# EAGLE schematic Hive 1.3 (EAGLE 9.6.2)
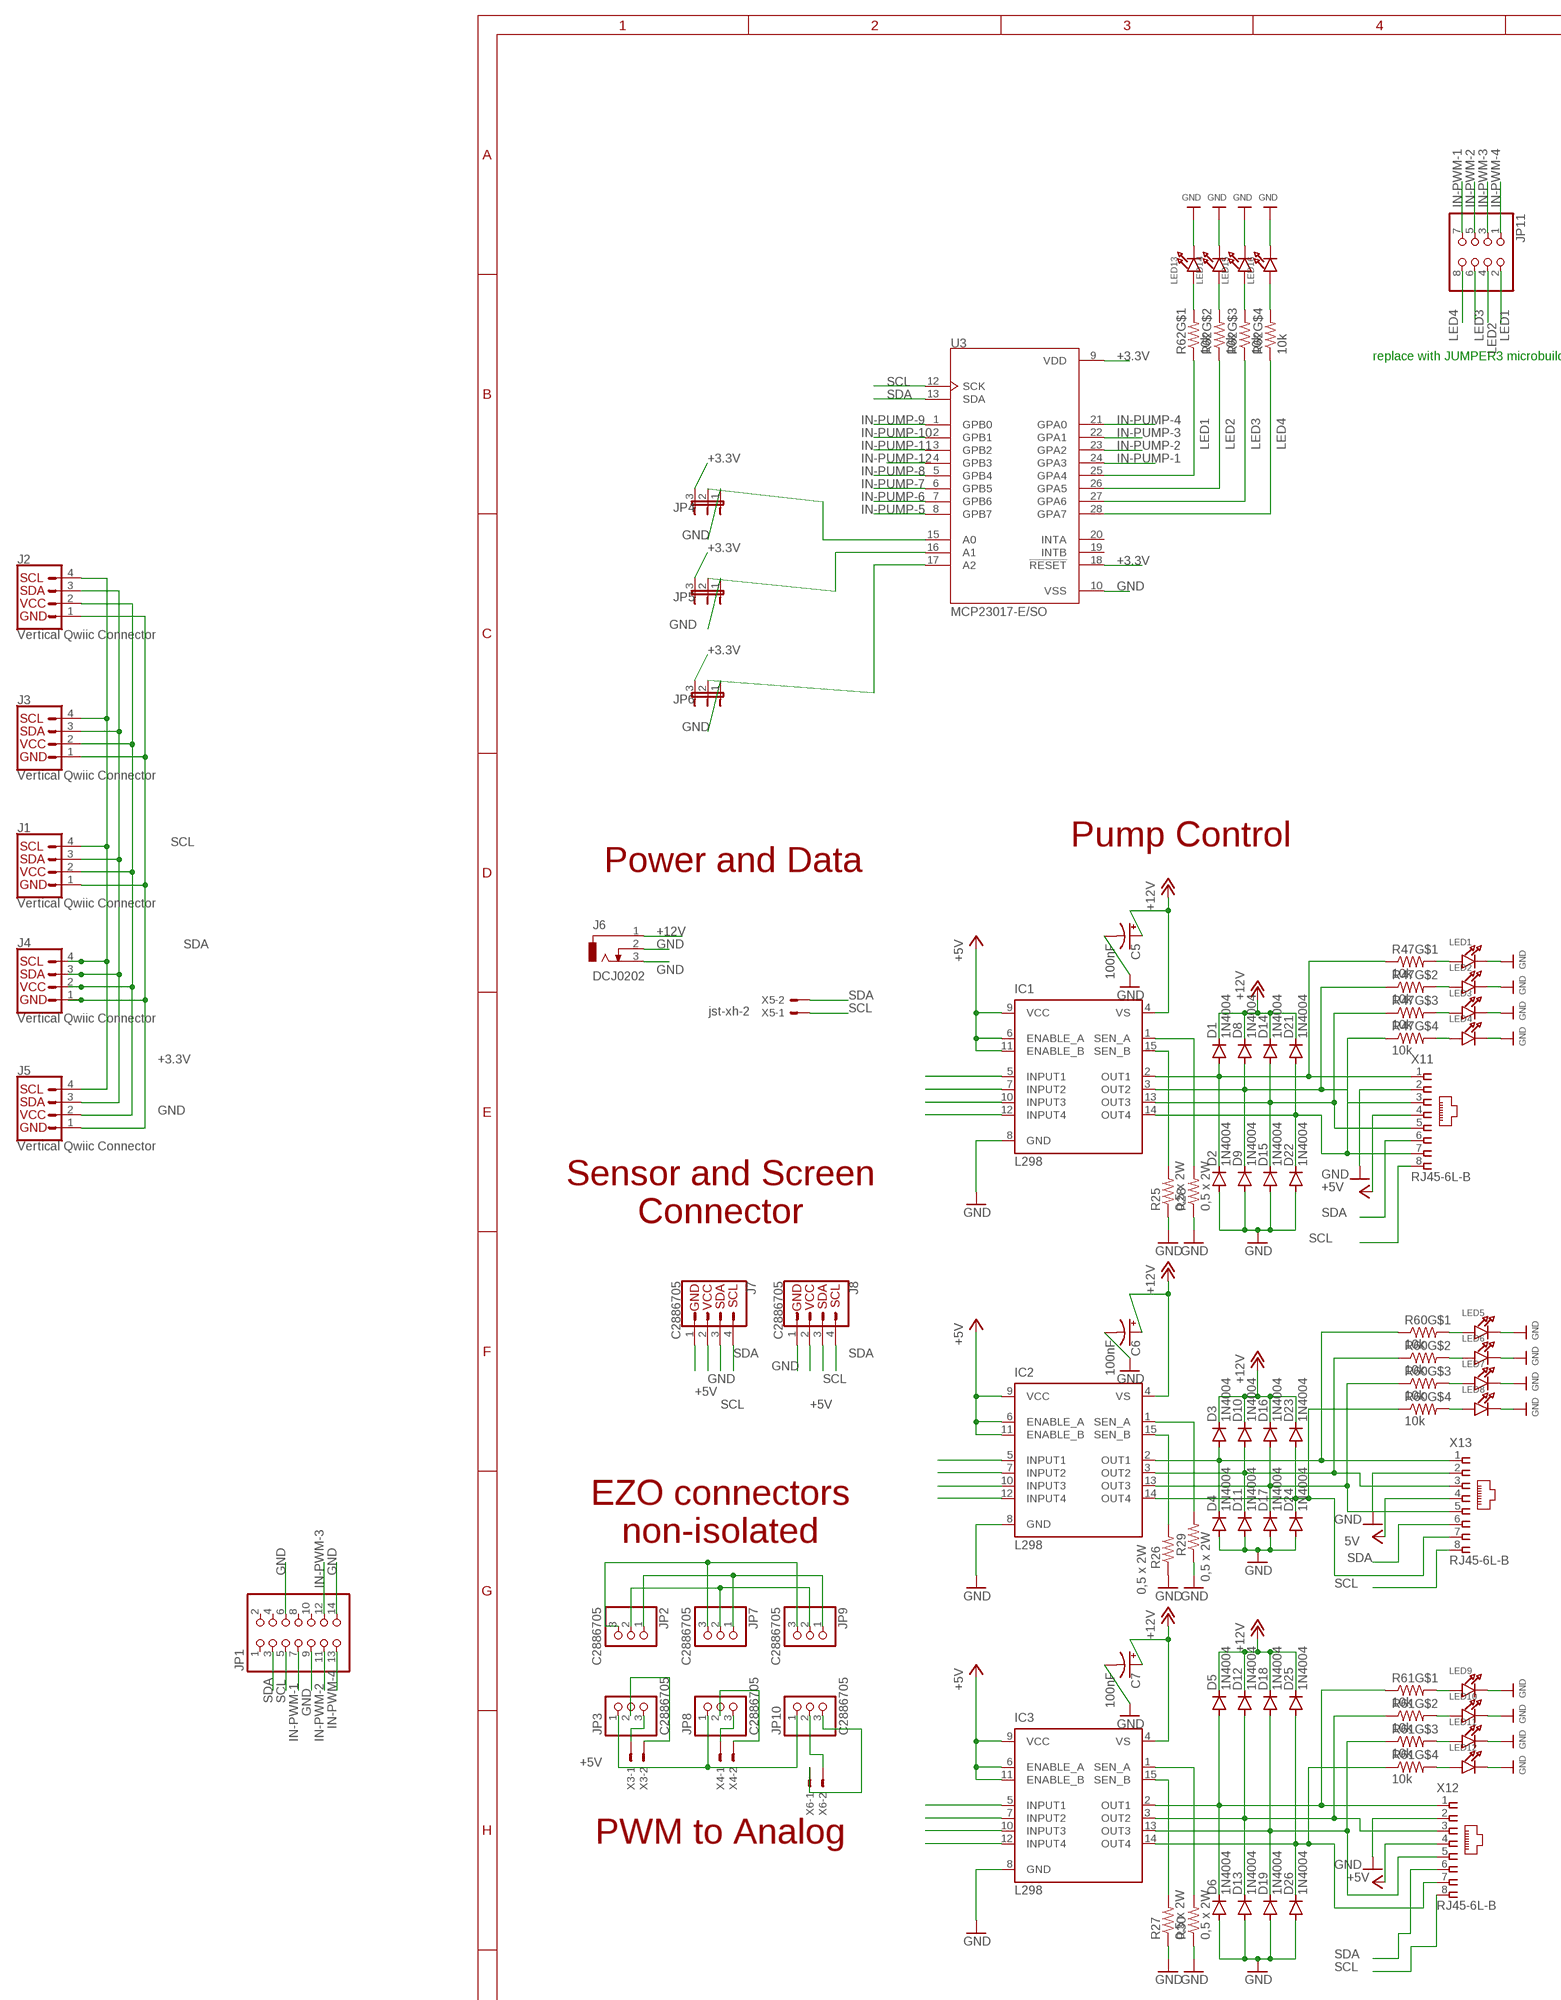
[diagram p0: schematic, sheet 1, part 1 of 3]
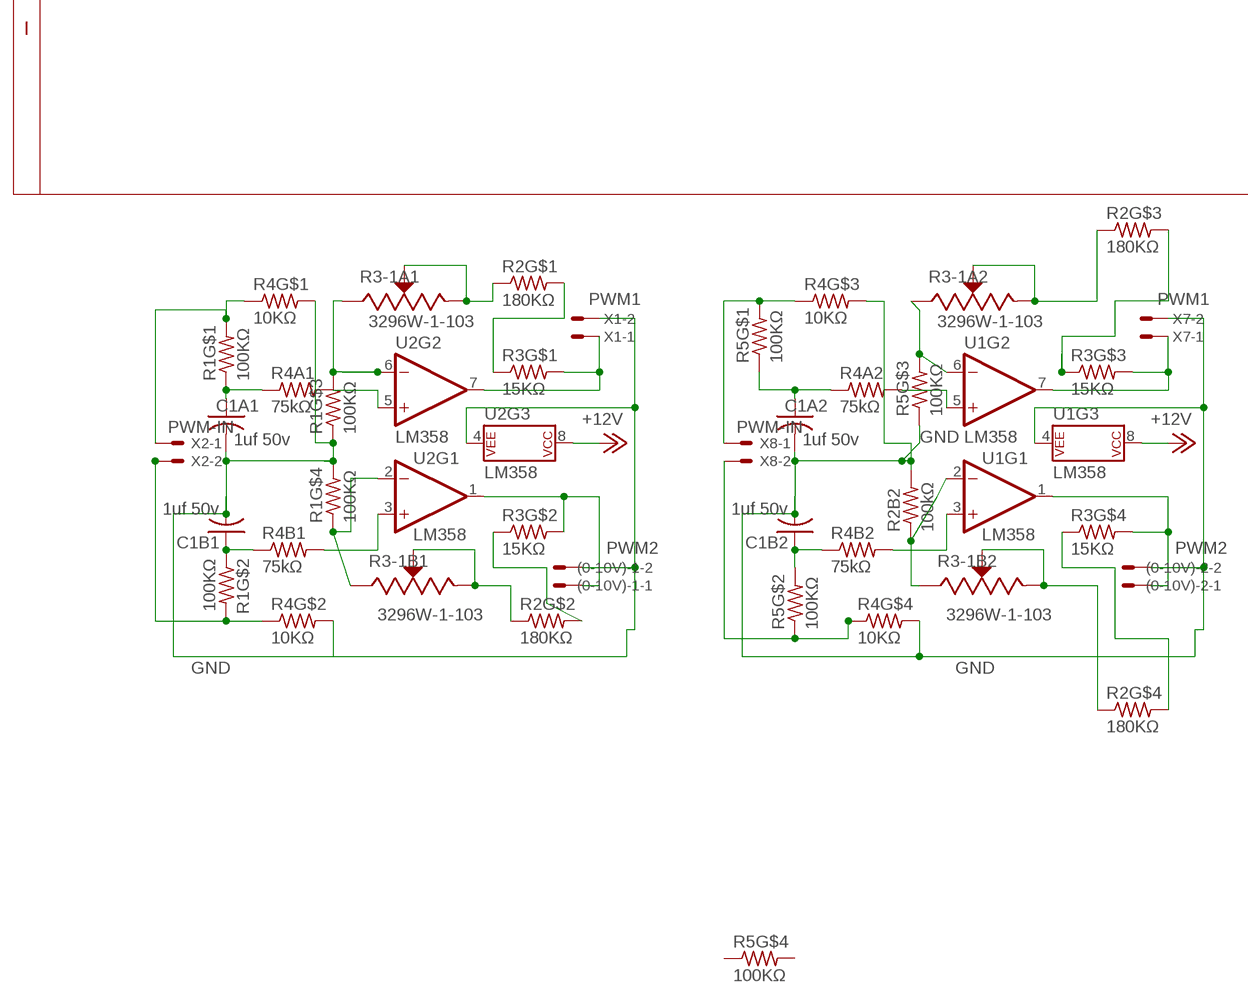
[diagram p1: schematic, sheet 1, part 2 of 3]
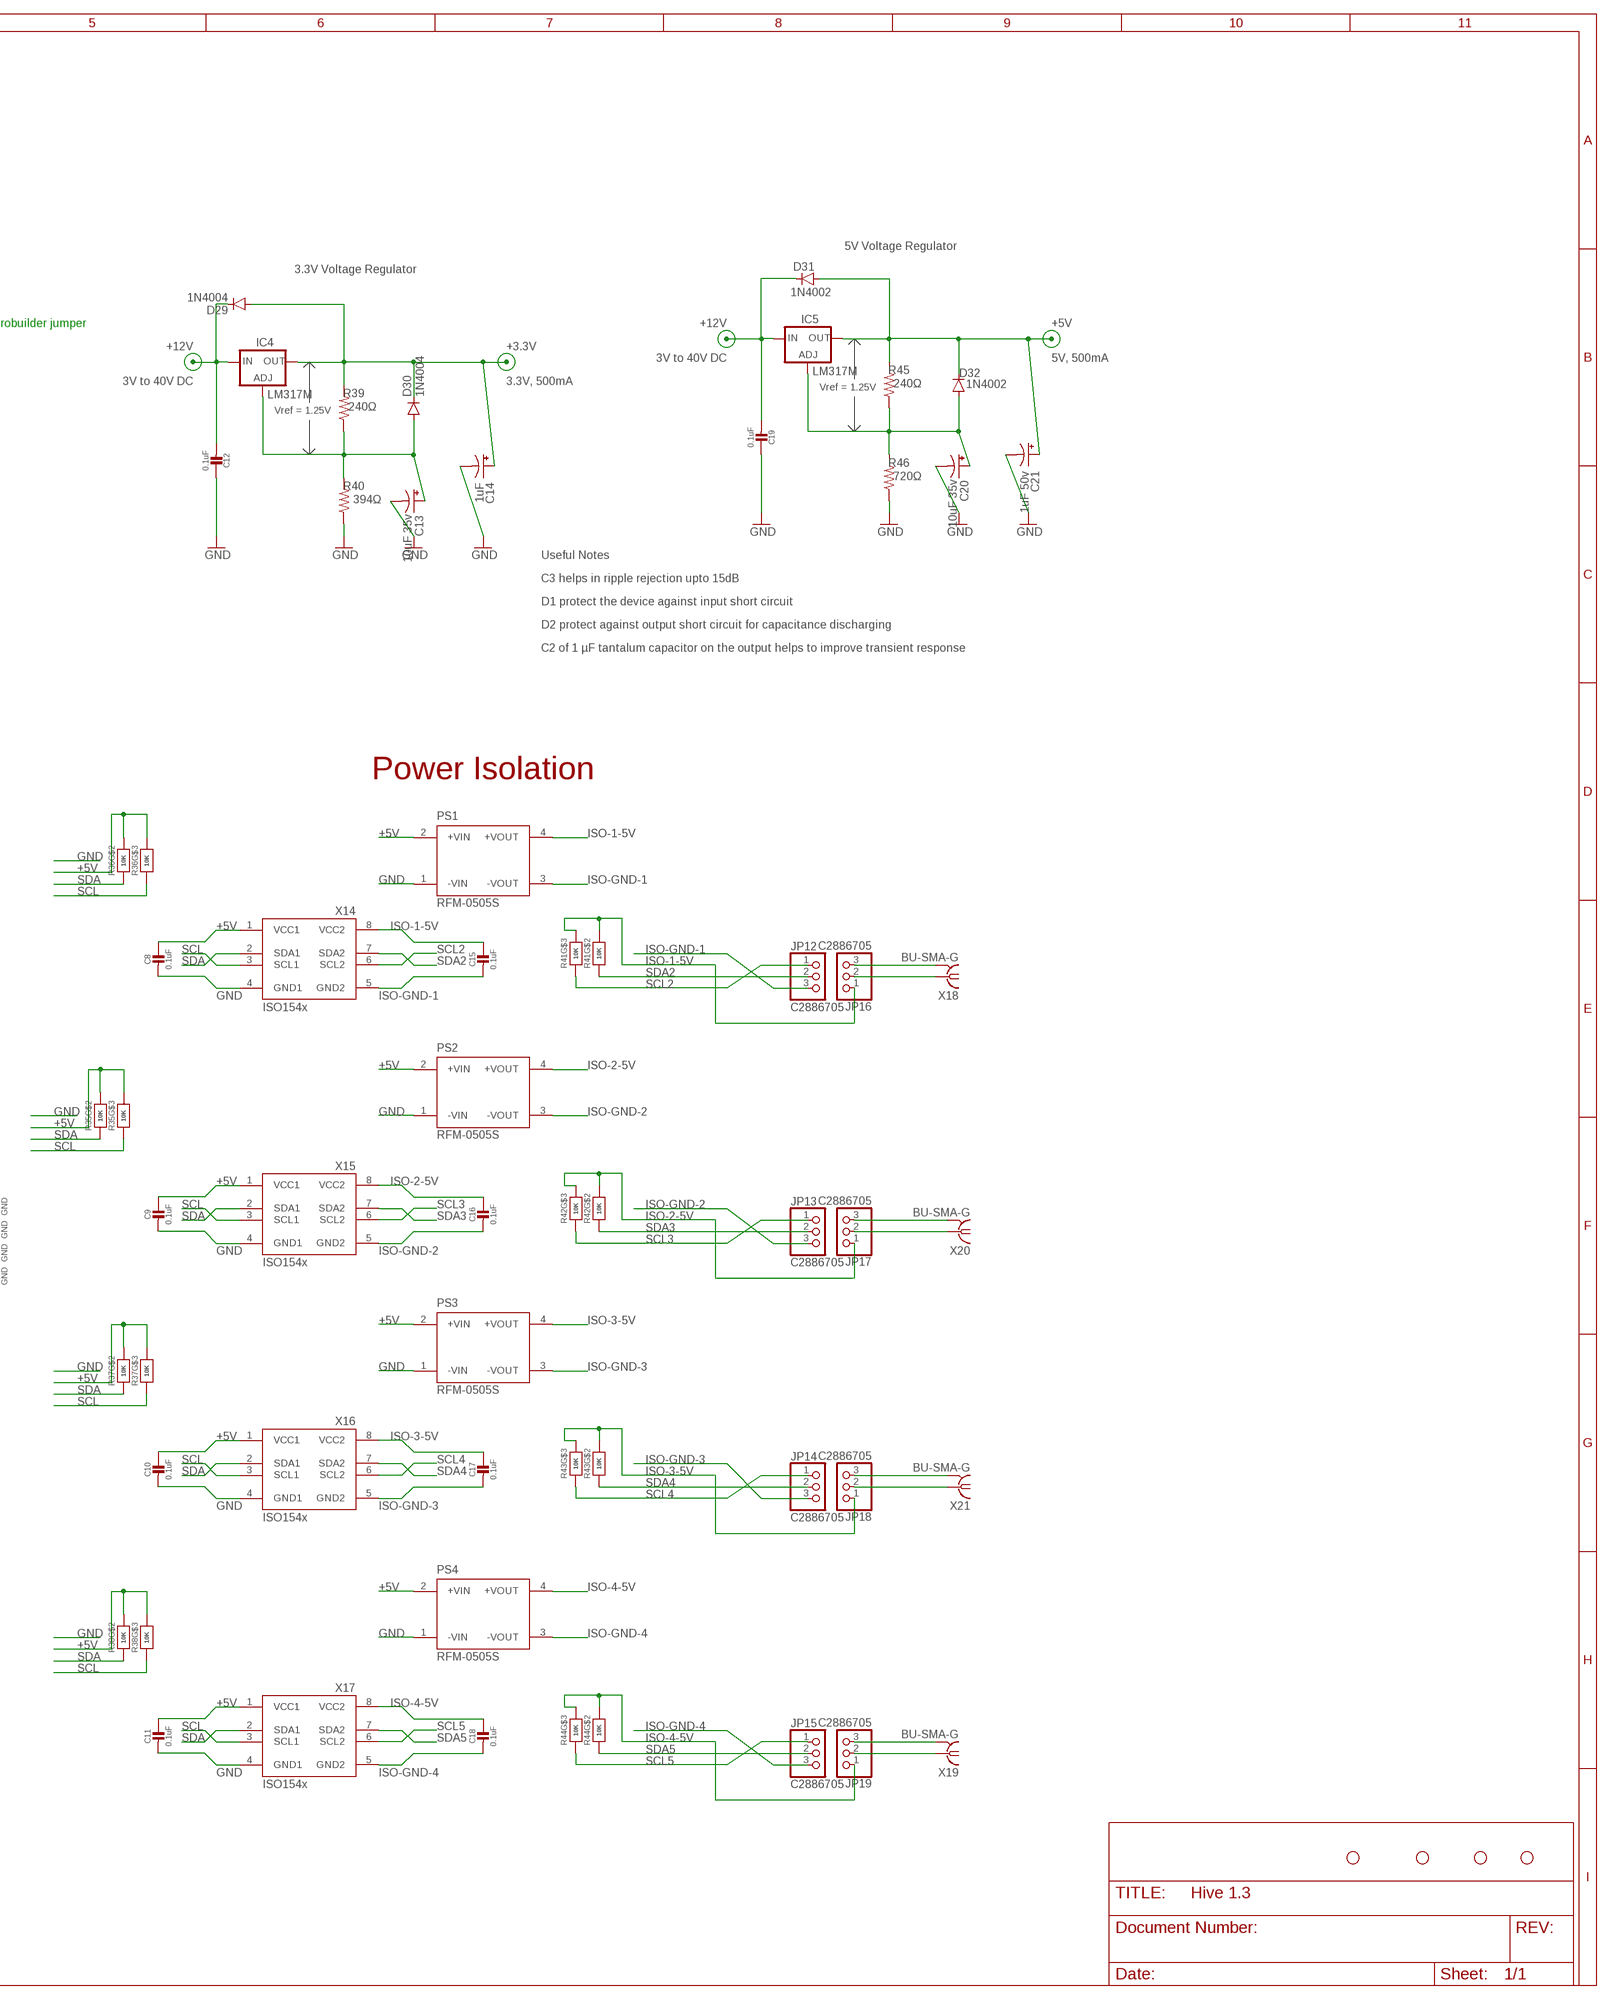
[diagram p2: schematic, sheet 1, part 3 of 3]

## Parts
(0-10V)-1  PWM2  JST-XH-02-PIN-LONG-PAD  [JST-XH-02-PACKAGE-LONG-PAD]
(0-10V)-2  PWM2  JST-XH-02-PIN-LONG-PAD  [JST-XH-02-PACKAGE-LONG-PAD]
C1A1  1uf 50v  C-USC1206  [C1206]
C1A2  1uf 50v  C-USC1206  [C1206]
C1B1  1uf 50v  C-USC1206  [C1206]
C1B2  1uf 50v  C-USC1206  [C1206]
C5  100nF  CPOL-USUD-4X5,8  [UD-4X5,8_NICHICON]
C6  100nF  CPOL-USUD-4X5,8  [UD-4X5,8_NICHICON]
C7  100nF  CPOL-USUD-4X5,8  [UD-4X5,8_NICHICON]
C8  0.1uF  CAP_CERAMIC0603_NO  [0603-NO]
C9  0.1uF  CAP_CERAMIC0603_NO  [0603-NO]
C10  0.1uF  CAP_CERAMIC0603_NO  [0603-NO]
C11  0.1uF  CAP_CERAMIC0603_NO  [0603-NO]
C12  0.1uF  CAP_CERAMIC0603_NO  [0603-NO]
C13  10uF 35v  CPOL-USUD-4X5,8  [UD-4X5,8_NICHICON]
C14  1uF  CPOL-USUD-4X5,8  [UD-4X5,8_NICHICON]
C15  0.1uF  CAP_CERAMIC0603_NO  [0603-NO]
C16  0.1uF  CAP_CERAMIC0603_NO  [0603-NO]
C17  0.1uF  CAP_CERAMIC0603_NO  [0603-NO]
C18  0.1uF  CAP_CERAMIC0603_NO  [0603-NO]
C19  0.1uF  CAP_CERAMIC0603_NO  [0603-NO]
C20  10uF 35v  CPOL-USUD-4X5,8  [UD-4X5,8_NICHICON]
C21  1uF 50v  CPOL-USUD-4X5,8  [UD-4X5,8_NICHICON]
D1  1N4004  DIODE-DO214BA  [DO214BA]
D2  1N4004  DIODE-DO214BA  [DO214BA]
D3  1N4004  DIODE-DO214BA  [DO214BA]
D4  1N4004  DIODE-DO214BA  [DO214BA]
D5  1N4004  DIODE-DO214BA  [DO214BA]
D6  1N4004  DIODE-DO214BA  [DO214BA]
D8  1N4004  DIODE-DO214BA  [DO214BA]
D9  1N4004  DIODE-DO214BA  [DO214BA]
D10  1N4004  DIODE-DO214BA  [DO214BA]
D11  1N4004  DIODE-DO214BA  [DO214BA]
D12  1N4004  DIODE-DO214BA  [DO214BA]
D13  1N4004  DIODE-DO214BA  [DO214BA]
D14  1N4004  DIODE-DO214BA  [DO214BA]
D15  1N4004  DIODE-DO214BA  [DO214BA]
D16  1N4004  DIODE-DO214BA  [DO214BA]
D17  1N4004  DIODE-DO214BA  [DO214BA]
D18  1N4004  DIODE-DO214BA  [DO214BA]
D19  1N4004  DIODE-DO214BA  [DO214BA]
D21  1N4004  DIODE-DO214BA  [DO214BA]
D22  1N4004  DIODE-DO214BA  [DO214BA]
D23  1N4004  DIODE-DO214BA  [DO214BA]
D24  1N4004  DIODE-DO214BA  [DO214BA]
D25  1N4004  DIODE-DO214BA  [DO214BA]
D26  1N4004  DIODE-DO214BA  [DO214BA]
D29  1N4004  DIODE-DO214BA  [DO214BA]
D30  1N4004  DIODE-DO214BA  [DO214BA]
D31  1N4002  DIODE-DO214BA  [DO214BA]
D32  1N4002  DIODE-DO214BA  [DO214BA]
H1  STAND-OFF  [STAND-OFF]
H2  STAND-OFF  [STAND-OFF]
H3  STAND-OFF  [STAND-OFF]
H4  STAND-OFF  [STAND-OFF]
IC1  L298  [MULTIWATT-15]
IC2  L298  [MULTIWATT-15]
IC3  L298  [MULTIWATT-15]
IC4  LM317MBSTT3  [SOT223]
IC5  LM317MBSTT3  [SOT223]
J1  Vertical Qwiic Connector  QWIIC_CONNECTOR  [JST04_1MM_VERT]
J2  Vertical Qwiic Connector  QWIIC_CONNECTOR  [JST04_1MM_VERT]
J3  Vertical Qwiic Connector  QWIIC_CONNECTOR  [JST04_1MM_VERT]
J4  Vertical Qwiic Connector  QWIIC_CONNECTOR  [JST04_1MM_VERT]
J5  Vertical Qwiic Connector  QWIIC_CONNECTOR  [JST04_1MM_VERT]
J6  DCJ0202  [DCJ0202]
J7  C2886705  I2C_STANDARD  [1X04]
J8  C2886705  I2C_STANDARD  [1X04]
JP1  PINHD-2X7  [2X07]
JP2  C2886705  PINHD-1X3CB  [1X03-CLEANBIG]
JP3  C2886705  PINHD-1X3CB  [1X03-CLEANBIG]
JP4  JUMPER3  [JUMPER3]
JP5  JUMPER3  [JUMPER3]
JP6  JUMPER3  [JUMPER3]
JP7  C2886705  PINHD-1X3CB  [1X03-CLEANBIG]
JP8  C2886705  PINHD-1X3CB  [1X03-CLEANBIG]
JP9  C2886705  PINHD-1X3CB  [1X03-CLEANBIG]
JP10  C2886705  PINHD-1X3CB  [1X03-CLEANBIG]
JP11  PINHD-2X4  [2X04]
JP12  C2886705  PINHD-1X3CB  [1X03-CLEANBIG]
JP13  C2886705  PINHD-1X3CB  [1X03-CLEANBIG]
JP14  C2886705  PINHD-1X3CB  [1X03-CLEANBIG]
JP15  C2886705  PINHD-1X3CB  [1X03-CLEANBIG]
JP16  C2886705  PINHD-1X3CB  [1X03-CLEANBIG]
JP17  C2886705  PINHD-1X3CB  [1X03-CLEANBIG]
JP18  C2886705  PINHD-1X3CB  [1X03-CLEANBIG]
JP19  C2886705  PINHD-1X3CB  [1X03-CLEANBIG]
LED1  LED0603  [CHIPLED_0603]
LED2  LED0603  [CHIPLED_0603]
LED3  LED0603  [CHIPLED_0603]
LED4  LED0603  [CHIPLED_0603]
LED5  LED0603  [CHIPLED_0603]
LED6  LED0603  [CHIPLED_0603]
LED7  LED0603  [CHIPLED_0603]
LED8  LED0603  [CHIPLED_0603]
LED9  LED0603  [CHIPLED_0603]
LED10  LED0603  [CHIPLED_0603]
LED11  LED0603  [CHIPLED_0603]
LED12  LED0603  [CHIPLED_0603]
LED13  LED0603  [CHIPLED_0603]
LED14  LED0603  [CHIPLED_0603]
LED15  LED0603  [CHIPLED_0603]
LED16  LED0603  [CHIPLED_0603]
PS1  RFM-0505S  [CONV_RFM-0505S]
PS2  RFM-0505S  [CONV_RFM-0505S]
PS3  RFM-0505S  [CONV_RFM-0505S]
PS4  RFM-0505S  [CONV_RFM-0505S]
R1  100KΩ  RESISTOR_4PACK_US  [RESPACK_4X0603]
R2  180KΩ  RESISTOR_4PACK_US  [RESPACK_4X0603]
R2B2  100kΩ  R-US_M1206  [M1206]
R3  15KΩ  RESISTOR_4PACK_US  [RESPACK_4X0603]
R3-1A1  3296W-1-103  [TRIM_3296W-1-103]
R3-1A2  3296W-1-103  [TRIM_3296W-1-103]
R3-1B1  3296W-1-103  [TRIM_3296W-1-103]
R3-1B2  3296W-1-103  [TRIM_3296W-1-103]
R4  10KΩ  RESISTOR_4PACK_US  [RESPACK_4X0603]
R4A1  75kΩ  R-US_M1206  [M1206]
R4A2  75kΩ  R-US_M1206  [M1206]
R4B1  75kΩ  R-US_M1206  [M1206]
R4B2  75kΩ  R-US_M1206  [M1206]
R5  100KΩ  RESISTOR_4PACK_US  [RESPACK_4X0603]
R25  0,5 x 2W  R-US_R2512  [R2512]
R26  0,5 x 2W  R-US_R2512  [R2512]
R27  0,5 x 2W  R-US_R2512  [R2512]
R28  0,5 x 2W  R-US_R2512  [R2512]
R29  0,5 x 2W  R-US_R2512  [R2512]
R30  0,5 x 2W  R-US_R2512  [R2512]
R35  10K  RESISTOR_4PACK  [RESPACK_4X0603]
R36  10K  RESISTOR_4PACK  [RESPACK_4X0603]
R37  10K  RESISTOR_4PACK  [RESPACK_4X0603]
R38  10K  RESISTOR_4PACK  [RESPACK_4X0603]
R39  240Ω  R-US_M0805  [M0805]
R40  394Ω  R-US_M0805  [M0805]
R41  10K  RESISTOR_4PACK  [RESPACK_4X0603]
R42  10K  RESISTOR_4PACK  [RESPACK_4X0603]
R43  10K  RESISTOR_4PACK  [RESPACK_4X0603]
R44  10K  RESISTOR_4PACK  [RESPACK_4X0603]
R45  240Ω  R-US_M0805  [M0805]
R46  720Ω  R-US_M0805  [M0805]
R47  10k  RESISTOR_4PACK_US  [RESPACK_4X0603]
R60  10k  RESISTOR_4PACK_US  [RESPACK_4X0603]
R61  10k  RESISTOR_4PACK_US  [RESPACK_4X0603]
R62  10k  RESISTOR_4PACK_US  [RESPACK_4X0603]
U1  LM358  [DIP08]
U2  LM358  [DIP08]
U3  MCP23017-E/SO  [SOIC127P1030X265-28N]
X1  PWM1  JST-XH-02-PIN-LONG-PAD  [JST-XH-02-PACKAGE-LONG-PAD]
X2  PWM-IN  JST-XH-02-PIN-LONG-PAD  [JST-XH-02-PACKAGE-LONG-PAD]
X3  jst-xh-2  JST-XH-02-PIN-LONG-PAD  [JST-XH-02-PACKAGE-LONG-PAD]
X4  jst-xh-2  JST-XH-02-PIN-LONG-PAD  [JST-XH-02-PACKAGE-LONG-PAD]
X5  jst-xh-2  JST-XH-02-PIN-LONG-PAD  [JST-XH-02-PACKAGE-LONG-PAD]
X6  jst-xh-2  JST-XH-02-PIN-LONG-PAD  [JST-XH-02-PACKAGE-LONG-PAD]
X7  PWM1  JST-XH-02-PIN-LONG-PAD  [JST-XH-02-PACKAGE-LONG-PAD]
X8  PWM-IN  JST-XH-02-PIN-LONG-PAD  [JST-XH-02-PACKAGE-LONG-PAD]
X11  RJ45-6L-B  [RJ45-NO-SHIELD]
X12  RJ45-6L-B  [RJ45-NO-SHIELD]
X13  RJ45-6L-B  [RJ45-NO-SHIELD]
X14  ISO154X  [SOIC8_150MIL]
X15  ISO154X  [SOIC8_150MIL]
X16  ISO154X  [SOIC8_150MIL]
X17  ISO154X  [SOIC8_150MIL]
X18  BU-SMA-G  [BU-SMA-G]
X19  BU-SMA-G  [BU-SMA-G]
X20  BU-SMA-G  [BU-SMA-G]
X21  BU-SMA-G  [BU-SMA-G]

## Nets
+3.3V [3.3v]: C14.+ D29.A D30.C IC4.4(OUT) J1.2 J2.2 J3.2 J4.2 J5.2 JP4.3 JP5.3 JP6.3 R39.2 U3.9(VDD) U3.18(!RESET)
+5V [5v]: C8.1 C9.1 C10.1 C11.1 C21.+ D31.A D32.C IC1.6(ENABLE_A) IC1.9(VCC) IC1.11(ENABLE_B) IC2.6(ENABLE_A) IC2.9(VCC) IC2.11(ENABLE_B) IC3.6(ENABLE_A) IC3.9(VCC) IC3.11(ENABLE_B) IC5.4(OUT) J7.1 J8.2 JP3.1 JP8.1 JP10.1 PS1.2(+VIN) PS2.2(+VIN) PS3.2(+VIN) PS4.2(+VIN) R35.6 R35.7 R36.6 R36.7 R37.6 R37.7 R38.6 R38.7 R45.2 X11.4 X12.4 X13.4 X14.1(VCC1) X15.1(VCC1) X16.1(VCC1) X17.1(VCC1) ; supply symbol labelled +3V3
+12V [12v]: C5.+ C6.+ C7.+ C12.2 C19.2 D1.C D3.C D5.C D8.C D10.C D12.C D14.C D16.C D18.C D21.C D23.C D25.C D29.C D31.C IC1.4(VS) IC2.4(VS) IC3.4(VS) IC4.3(IN) IC5.3(IN) J6.1 U1.8(P$V+) U2.8(P$V+)
GND: (0-10V)-1.2 (0-10V)-2.2 C1A1.2 C1A2.2 C1B1.2 C1B2.2 C5.- C6.- C7.- C8.2 C9.2 C10.2 C11.2 C12.1 C13.- C14.- C19.1 C20.- C21.- D2.A D4.A D6.A D9.A D11.A D13.A D15.A D17.A D19.A D22.A D24.A D26.A IC1.8(GND) IC2.8(GND) IC3.8(GND) J1.1 J2.1 J3.1 J4.1 J5.1 J6.2 J6.3 J7.2 J8.1 JP1.6 JP1.9 JP1.14 JP2.3 JP4.1 JP5.1 JP6.1 JP7.3 JP9.3 LED1.C LED2.C LED3.C LED4.C LED5.C LED6.C LED7.C LED8.C LED9.C LED10.C LED11.C LED12.C LED13.C LED14.C LED15.C LED16.C PS1.1(-VIN) PS2.1(-VIN) PS3.1(-VIN) PS4.1(-VIN) R1.3 R1.5 R2B2.2 R4.5 R4.6 R4.7 R4.8 R5.3 R25.1 R26.1 R27.1 R28.1 R29.1 R30.1 R40.1 R46.1 U1.4(P$V-) U2.4(P$V-) U3.10(VSS) X1.2 X7.2 X11.2 X12.2 X13.2 X14.4(GND1) X15.4(GND1) X16.4(GND1) X17.4(GND1)
IN-PUMP-1: IC2.5(INPUT1) U3.24(GPA3)
IN-PUMP-2: IC2.7(INPUT2) U3.23(GPA2)
IN-PUMP-3: IC2.10(INPUT3) U3.22(GPA1)
IN-PUMP-4: IC2.12(INPUT4) U3.21(GPA0)
IN-PUMP-5 [GPIO]: IC1.5(INPUT1) U3.8(GPB7)
IN-PUMP-6 [GPIO]: IC1.7(INPUT2) U3.7(GPB6)
IN-PUMP-7 [GPIO]: IC1.10(INPUT3) U3.6(GPB5)
IN-PUMP-8 [GPIO]: IC1.12(INPUT4) U3.5(GPB4)
IN-PUMP-9 [GPIO]: IC3.5(INPUT1) U3.1(GPB0)
IN-PUMP-10 [GPIO]: IC3.7(INPUT2) U3.2(GPB1)
IN-PUMP-11 [GPIO]: IC3.10(INPUT3) U3.3(GPB2)
IN-PUMP-12 [GPIO]: IC3.12(INPUT4) U3.4(GPB3)
IN-PWM-1: JP1.7 JP11.7
IN-PWM-2: JP1.11 JP11.5
IN-PWM-3: JP1.12 JP11.3
IN-PWM-4: JP1.13 JP11.1
IN-PWM-5: R1.8 R4.1 X2.1
IN-PWM-6: R1.7 R4.2 X2.2
IN-PWM-7: R4.3 R5.8 X8.1
IN-PWM-8: R4.4 R5.2 X8.2
ISO-1-5V: C15.1 JP16.1 PS1.4(+VOUT) R41.6 R41.7 X14.8(VCC2)
ISO-2-5V: C16.1 JP17.1 PS2.4(+VOUT) R42.6 R42.7 X15.8(VCC2)
ISO-3-5V: C17.1 JP18.1 PS3.4(+VOUT) R43.6 R43.7 X16.8(VCC2)
ISO-4-5V: C18.1 JP19.1 PS4.4(+VOUT) R44.6 R44.7 X17.8(VCC2)
ISO-GND-1: C15.2 JP12.3 PS1.3(-VOUT) X14.5(GND2)
ISO-GND-2: C16.2 JP13.3 PS2.3(-VOUT) X15.5(GND2)
ISO-GND-3: C17.2 JP14.3 PS3.3(-VOUT) X16.5(GND2)
ISO-GND-4: C18.2 JP15.3 PS4.3(-VOUT) X17.5(GND2)
LED1: JP11.2 R62.1 U3.25(GPA4)
LED2: JP11.4 R62.2 U3.26(GPA5)
LED3: JP11.6 R62.3 U3.27(GPA6)
LED4: JP11.8 R62.4 U3.28(GPA7)
N$1: IC1.1(SEN_A) R28.2
N$2: IC1.15(SEN_B) R25.2
N$3: IC3.1(SEN_A) R30.2
N$4: IC3.15(SEN_B) R27.2
N$5: C13.+ D30.A IC4.1(ADJ) R39.1 R40.2
N$6: R1.6 R3-1A1.1(CCW) U2.6(-IN)
N$7: LED13.A R62.8
N$8: R1.4 R3-1B1.1(CCW) U2.2(-IN)
N$9: IC2.1(SEN_A) R29.2
N$10: IC2.15(SEN_B) R26.2
N$11: C20.+ D32.A IC5.1(ADJ) R45.1 R46.2
N$12: JP19.3 X19.2 X19.3 X19.4 X19.5
N$13: LED14.A R62.7
N$14: JP17.3 X20.2 X20.3 X20.4 X20.5
N$15: JP18.3 X21.2 X21.3 X21.4 X21.5
N$16: JP16.2 X18.1
N$17: R2.2 R3-1B1.2(WIPER) R3-1B1.3(CW)
N$18: R2.7 R3.2
N$19: R2.1 R3-1A1.2(WIPER) R3-1A1.3(CW)
N$20: R2.8 R3.1
N$21: C1A1.1 R1.1 R4A1.1
N$22: C1B1.1 R1.2 R4B1.1
N$23: LED9.A R61.8
N$24: LED10.A R61.7
N$25: R4A1.2 U2.5(+IN)
N$26: R4B1.2 U2.3(+IN)
N$27: R2.4 R3-1B2.2(WIPER) R3-1B2.3(CW)
N$28: LED11.A R61.6
N$29: LED12.A R61.5
N$30: LED8.A R60.5
N$31: JP10.2 X6.2
N$32: JP17.2 X20.1
N$33: JP10.3 X6.1
N$34: JP8.3 X4.1
N$35: JP8.2 X4.2
N$36: JP18.2 X21.1
N$37: JP3.3 X3.1
N$38: JP3.2 X3.2
N$39: LED7.A R60.6
N$40: JP19.2 X19.1
N$41: LED6.A R60.7
N$42: JP16.3 X18.2 X18.3 X18.4 X18.5
N$43: LED5.A R60.8
N$44: LED1.A R47.8
N$45: LED2.A R47.7
N$46: LED3.A R47.6
N$47: LED4.A R47.5
N$48: LED15.A R62.6
N$49: LED16.A R62.5
N$50: R2.5 R3.4
N$51: R2.3 R3-1A2.2(WIPER) R3-1A2.3(CW)
N$52: R2.6 R3.3
N$53: C1A2.1 R4A2.1 R5.1
N$54: C1B2.1 R4B2.1 R5.7
N$55: R3-1A2.1(CCW) R5.6 U1.6(-IN)
N$56: R2B2.1 R3-1B2.1(CCW) U1.2(-IN)
N$57: R4A2.2 U1.5(+IN)
N$58: R4B2.2 U1.3(+IN)
N$74: JP4.2 U3.15(A0)
N$75: JP5.2 U3.16(A1)
N$76: JP6.2 U3.17(A2)
OUT-PUMP-1 [highpower]: D3.A D4.C IC2.2(OUT1) R60.1 X13.1
OUT-PUMP-2 [highpower]: D10.A D11.C IC2.3(OUT2) R60.2 X13.3
OUT-PUMP-3 [highpower]: D16.A D17.C IC2.13(OUT3) R60.3 X13.5
OUT-PUMP-4 [highpower]: D23.A D24.C IC2.14(OUT4) R60.4 X13.7
OUT-PUMP-5 [highpower]: D1.A D2.C IC1.2(OUT1) R47.1 X11.1
OUT-PUMP-6 [highpower]: D8.A D9.C IC1.3(OUT2) R47.2 X11.3
OUT-PUMP-7 [highpower]: D14.A D15.C IC1.13(OUT3) R47.3 X11.5
OUT-PUMP-8 [highpower]: D21.A D22.C IC1.14(OUT4) R47.4 X11.7
OUT-PUMP-9 [highpower]: D5.A D6.C IC3.2(OUT1) R61.1 X12.1
OUT-PUMP-10 [highpower]: D12.A D13.C IC3.3(OUT2) R61.2 X12.3
OUT-PUMP-11 [highpower]: D18.A D19.C IC3.13(OUT3) R61.3 X12.5
OUT-PUMP-12: D25.A D26.C IC3.14(OUT4) R61.4 X12.7
OUTA: R3.8 U2.7(OUT) X1.1
OUTA1: R3.6 U1.7(OUT) X7.1
OUTB: (0-10V)-1.1 R3.7 U2.1(OUT)
OUTB1: (0-10V)-2.1 R3.5 U1.1(OUT)
SCL: J1.4 J2.4 J3.4 J4.4 J5.4 J7.3 J8.3 JP1.5 JP2.1 JP7.1 JP9.1 R35.3 R36.3 R37.3 R38.3 U3.12(SCK) X5.1 X11.8 X12.8 X13.8 X14.3(SCL1) X15.3(SCL1) X16.3(SCL1) X17.3(SCL1)
SCL2: JP12.1 R41.3 X14.6(SCL2)
SCL3: JP13.1 R42.3 X15.6(SCL2)
SCL4: JP14.1 R43.3 X16.6(SCL2)
SCL5: JP15.1 R44.3 X17.6(SCL2)
SDA: J1.3 J2.3 J3.3 J4.3 J5.3 J7.4 J8.4 JP1.3 JP2.2 JP7.2 JP9.2 R35.2 R36.2 R37.2 R38.2 U3.13(SDA) X5.2 X11.6 X12.6 X13.6 X14.2(SDA1) X15.2(SDA1) X16.2(SDA1) X17.2(SDA1)
SDA2: JP12.2 R41.2 X14.7(SDA2)
SDA3: JP13.2 R42.2 X15.7(SDA2)
SDA4: JP14.2 R43.2 X16.7(SDA2)
SDA5: JP15.2 R44.2 X17.7(SDA2)
Unconnected: JP1.1 JP1.2 JP1.4 JP1.8 JP1.10 R5.4 R5.5 R35.1 R35.4 R35.5 R35.8 R36.1 R36.4 R36.5 R36.8 R37.1 R37.4 R37.5 R37.8 R38.1 R38.4 R38.5 R38.8 R41.1 R41.4 R41.5 R41.8 R42.1 R42.4 R42.5 R42.8 R43.1 R43.4 R43.5 R43.8 R44.1 R44.4 R44.5 R44.8 U3.19(INTB) U3.20(INTA)

## Notes on the sheet
- 5V Voltage Regulator
- 3.3V Voltage Regulator
- replace with JUMPER3 microbuilder jumper
- 3V to 40V DC | 5V, 500mA
- 3V to 40V DC | 3.3V, 500mA
- Vref = 1.25V
- Vref = 1.25V
- Useful Notes
- C3 helps in ripple rejection upto 15dB
- D1 protect the device against input short circuit
- D2 protect against output short circuit for capacitance discharging
- C2 of 1 µF tantalum capacitor on the output helps to improve transient response
- Pump Control
- Power Isolation
- Power and Data
- Sensor and Screen
  Connector
- EZO connectors
  non-isolated
- PWM to Analog

## Library data of the parts
(0-10V)-1 (0-10V)-2 X1-X8 = Rembrandt Electronics - JST XH Connectors v1-0:JST-XH-02-PIN: JST XH Connector 2 Pin Wire to board connector. Pitch: 2,54 mm, (0.100") Number of pins: 2 Created by Rembrandt Electronics www.rembrandtelectronics.com
C1A1 C1A2 C1B1 C1B2 = adafruit:C-US: CAPACITOR, American symbol
C5-C7 C13 C14 C20 C21 = rcl:CPOL-US: POLARIZED CAPACITOR, American symbol; SPICEPREFIX: C
C8-C12 C15-C19 = microbuilder:CAP_CERAMIC: Ceramic Capacitors For new designs, use the packages preceded by an '_' character since they are more reliable: The following footprints should be used on most boards: _0402 - Standard footprint for regular board layouts _0603 - Standard footprint for regular board layouts _0805 - Standard footprint for regular board layouts _1206 - Standard footprint for regular board layouts For extremely tight-pitch boards where space is at a premium, the following 'micro-pitch' footprints can be used (smaller pads, no silkscreen outline, etc.): _0402MP - Micro-pitch footprint for very dense/compact boards _0603MP - Micro-pitch footprint for very dense/compact boards _0805MP - Micro-pitch footprint for very dense/compact boards _1206MP - Micro-pitch footprint for very dense/compact boards
D1-D6 D8-D19 D21-D26 D29-D32 = diode:DIODE-: DIODE
H1-H4 = SparkFun-Hardware:STAND-OFF: Stand Off Drill holes for mechanically mounting via screws, standoffs, etc. Note: Use the keepout ring to avoid running the screw head into surrounding components. Variant Overviews STAND-OFF - Mechanical footprint for a #4 phillips button head screw. STAND-OFF-TIGHT - Mechanical footprint for a #4 phillips button head screw, Example SparkFun Products Screw - Phillips Head (1/4", 4-40, 10 pack) <https://www.sparkfun.com/products/10453> (PRT-10453) Screw - Phillips Head (1/2", 4-40, 10 pack) <https://www.sparkfun.com/products/10452> (PRT-10452) Screw - Phillips Head (3/4", 4-40, 10 pack) <https://www.sparkfun.com/products/10451> (PRT-10451) Screw - Phillips Head (1", 4-40, 10 pack) <https://www.sparkfun.com/products/10450> (PRT-10450)
IC1-IC3 = st-microelectronics:L298: DUAL FULL-BRIDGE DRIVER; MPN: L298N; OC_FARNELL: 1589425; OC_NEWARK: 32M1527
IC4 IC5 = v-reg:LM317?*: 500 mA Adjustable Output Positive Voltage Regulator Source: http://www.onsemi.co.jp .. LM317M-D.PDF; PARTNUMBER: LM317M
J1-J5 = SparkFun-Connectors:QWIIC_CONNECTOR: SparkFun I2C Standard Qwiic Connector An SMD 1mm pitch JST connector makes it easy and quick (get it? Qwiic?) to connect I2C devices to each other. The Qwiic system <http://www.sparkfun.com/qwiic> enables fast and solderless connection between popular platforms and various sensors and actuators. We carry 200mm <https://www.sparkfun.com/products/14204>, 100mm <https://www.sparkfun.com/products/14205>, 50mm <https://www.sparkfun.com/products/14206>, and breadboard friendly <https://www.sparkfun.com/products/14207> Qwiic cables. We also offer 10 pcs strips <https://www.sparkfun.com/products/14323> the SMD connectors.; PROD_ID: CONN-14483
J6 = con-jack:DCJ0202: DC POWER JACK Source: DCJ0202.pdf; OC_FARNELL: unknown; OC_NEWARK: unknown
J7 J8 = SparkFun-Connectors:I2C_STANDARD: SparkFun I2C Standard Pinout Header SparkFun has standardized on a pinout for all I2C based sensor breakouts. This pinout allows I2C boards to be plugged directly into the headers on Arduino Uno compatible boards, and to be daisy chained easily. Example SparkFun Products: SparkFun Atmospheric Sensor Breakout - BME280 <https://www.sparkfun.com/products/13676> SparkFun Altitude/Pressure Sensor Breakout - MPL3115A2 <https://www.sparkfun.com/products/11084> SparkFun TOF Range Finder Sensor - VL6180 <https://www.sparkfun.com/products/12785>
JP1 = pinhead:PINHD-2X7: PIN HEADER
JP2 JP3 JP7-JP10 JP12-JP19 = adafruit:PINHD-1X3: PIN HEADER
JP4-JP6 = microbuilder:JUMPER3: JUMPER - 3 Pins
JP11 = pinhead:PINHD-2X4: PIN HEADER
LED1-LED16 = microbuilder:LED: LED 0603 - 0603 Surface Mount Package 2mA: Green LED - Low Power (3.9mcd, 2ma, 1.7Vf) - Digikey: 475-2709-2-ND Orange LED - Low Power (9.8mcd, 2ma, 1.8Vf) - Digikey: 475-1194-2-ND Red LED - Low Power (5mcd, 2ma, 1.8Vf) - Digikey: 475-1195-2-ND Yellow LED - Low Power (7mcd, 2ma, 1.8Vf) - Digikey: 475-1196-2-ND 5mA: Blue LED - Low Power (17mcd, 5ma, 2.9Vf) - Digikey: LNJ937W8CRACT-ND 0805 - 0805 Surface Mount Package 2mA: Red LED (8.8mcd, 2mA, 1.8Vf, Clear) - Low Power [Digikey: 475-2510-1-ND] Green LED (5mcd, 2mA, 1.8Vf, Clear) - Low Power [Digikey: 475-2730-1-ND] Yellow LED (11.3mcd, 2mA, 1.8Vf, Clear) - Low Power [Digikey: 475-2555-1-ND] 20mA: Red LED (104mcd, 20mA, Diffused) - LS R976 [Digikey: 475-1278-6-ND] Red LED (12mcd, 20mA, 2.0Vf, Clear) - APT2012EC [Digikey: 754-1128-1-ND] Green LED (15mcd, 20mA, 2.2Vf, Clear) - APT2012GC [Digikey: 754-1131-1-ND] Orange LED (160mcd, 20mA, 2.1Vf, Clear) - APT2012SECK [Digikey: 754-1130-1-ND] 1206 - 1206 Surface Mount Package Green LED (26mcd, 20mA, Diffused) - LG N971 [Digikey: 475-1407-6-ND] Red LED (15mcd, 20mA, Diffused) - LH N974 [Digikey: 475-1416-6-ND]
PS1-PS4 = RFM-0505S:RFM-0505S: DC/DC Converter, 1 Watt, SIP4, Single Output Check availability <https://pricing.snapeda.com/parts/RFM-0505S/Recom%20Power/view-part?ref=eda>; AVAILABILITY: In Stock; DESCRIPTION: 1W DC/DC-Converter 'ECONOLINE' SIP4 1kV unreg; MF: Recom Power; MP: RFM-0505S; PACKAGE: SIP-4 Recom Power; PRICE: None; PURCHASE-URL: https://pricing.snapeda.com/search/part/RFM-0505S/?ref=eda
R1-R5 R47 R60-R62 = microbuilder:RESISTOR_4PACK_US: Resistor Packs (4 resistors) 4 x 0603 10K 1/16W - Digikey: YC164J-10KCT-ND
R2B2 R4A1 R4A2 R4B1 R4B2 R25-R30 = adafruit:R-US_: RESISTOR, American symbol
R3-1A1 R3-1A2 R3-1B1 R3-1B2 = 3296W-1-103:3296W-1-103: Res Cermet Trimmer 500K Ohm 10% 0.5W 25(Elec)Turn 2.19mm (9.53 X 4.83 X 11.55mm) Pin Thru-Hole Tube Check availability <https://pricing.snapeda.com/parts/3296W-1-103/Bourns/view-part?ref=eda>; AVAILABILITY: In Stock; DESCRIPTION: 10 kOhms 0.5W, 1/2W PC Pins Through Hole Trimmer Potentiometer Cermet 25.0 Turn Top Adjustment; MF: Bourns; MP: 3296W-1-103; PACKAGE: SOT-23-5 Bourns; PRICE: None; PURCHASE-URL: https://pricing.snapeda.com/search/part/3296W-1-103/?ref=eda
R35-R38 R41-R44 = microbuilder:RESISTOR_4PACK: Resistor Packs (4 resistors) 4 x 0603 10K 1/16W - Digikey: YC164J-10KCT-ND
R39 R40 R45 R46 = resistor:R-US_: RESISTOR, American symbol
U1 U2 = SparkFun-IC-Amplifiers:LM358: LM358 Jellybean op-amp Datasheet <http://www.sparkfun.com/datasheets/Components/General/LM358.pdf> SparkFun Products Op-Amp (Thru-Hole) - LM358 <https://www.sparkfun.com/products/9456> (COM-09456); PROD_ID: IC-09172
U3 = MCP23017-E_SO:MCP23017-E/SO: MCP23017 Series 5.5 V 1.7 MHz SMT 16-Bit I2C I/O Expander - SOIC-28 Check availability <https://pricing.snapeda.com/parts/MCP23017-E/SO/Microchip/view-part?ref=eda>; AVAILABILITY: In Stock; DESCRIPTION: I/O Expander 16 I²C 1.7 MHz 28-SOIC; MF: Microchip; MP: MCP23017-E/SO; PACKAGE: SOIC-28 Microchip; PRICE: None; PURCHASE-URL: https://pricing.snapeda.com/search/part/MCP23017-E/SO/?ref=eda
X11-X13 = con-tycoelectronics:RJ45: CORCOM Modular RJ Jacks No Shield Source: www.tycoelectronics.com .. ENG_DS_1654001_1099_RJ_L_0507.pdf; MPN: RJ45-6L-B; OC_FARNELL: unknown; OC_NEWARK: 16R6090
X14-X17 = adafruit_power:ISO154X
X18-X21 = con-coax:BU-SMA-G: FEMALE SMA CONNECTOR Radiall distributor RS 193-9117; OC_FARNELL: unknown; OC_NEWARK: unknown

## Net classes
0 default: width 0.152 mm
1 highpower: width 0.356 mm, drill 0.356 mm
2 12v: width 0.457 mm, drill 0.102 mm, clearance 0.254 mm
3 5v: width 0.406 mm, drill 0.102 mm, clearance 0.254 mm
4 3.3v: width 0.406 mm, drill 0.102 mm, clearance 0.254 mm
5 i2c: width 0.356 mm, drill 0.102 mm, clearance 0.254 mm
6 GPIO: width 0.356 mm, drill 0.102 mm, clearance 0.254 mm
8 New Class: drill 0.102 mm, clearance 0.152 mm